# Altium schematic sheet Differential_driver.SchDoc: RP2040 CNC
size B; Author: AM; CompanyName: Expatria Technologies; DrawnBy: A.Marles; Engineer: AM; Organization: Expatria Technolgoies; Address1: PO Box 2084; Address3: Merritt, BC V1K 1B8; Address4: Canada; DocumentNumber: 12; SheetNumber: 28; SheetTotal: 28
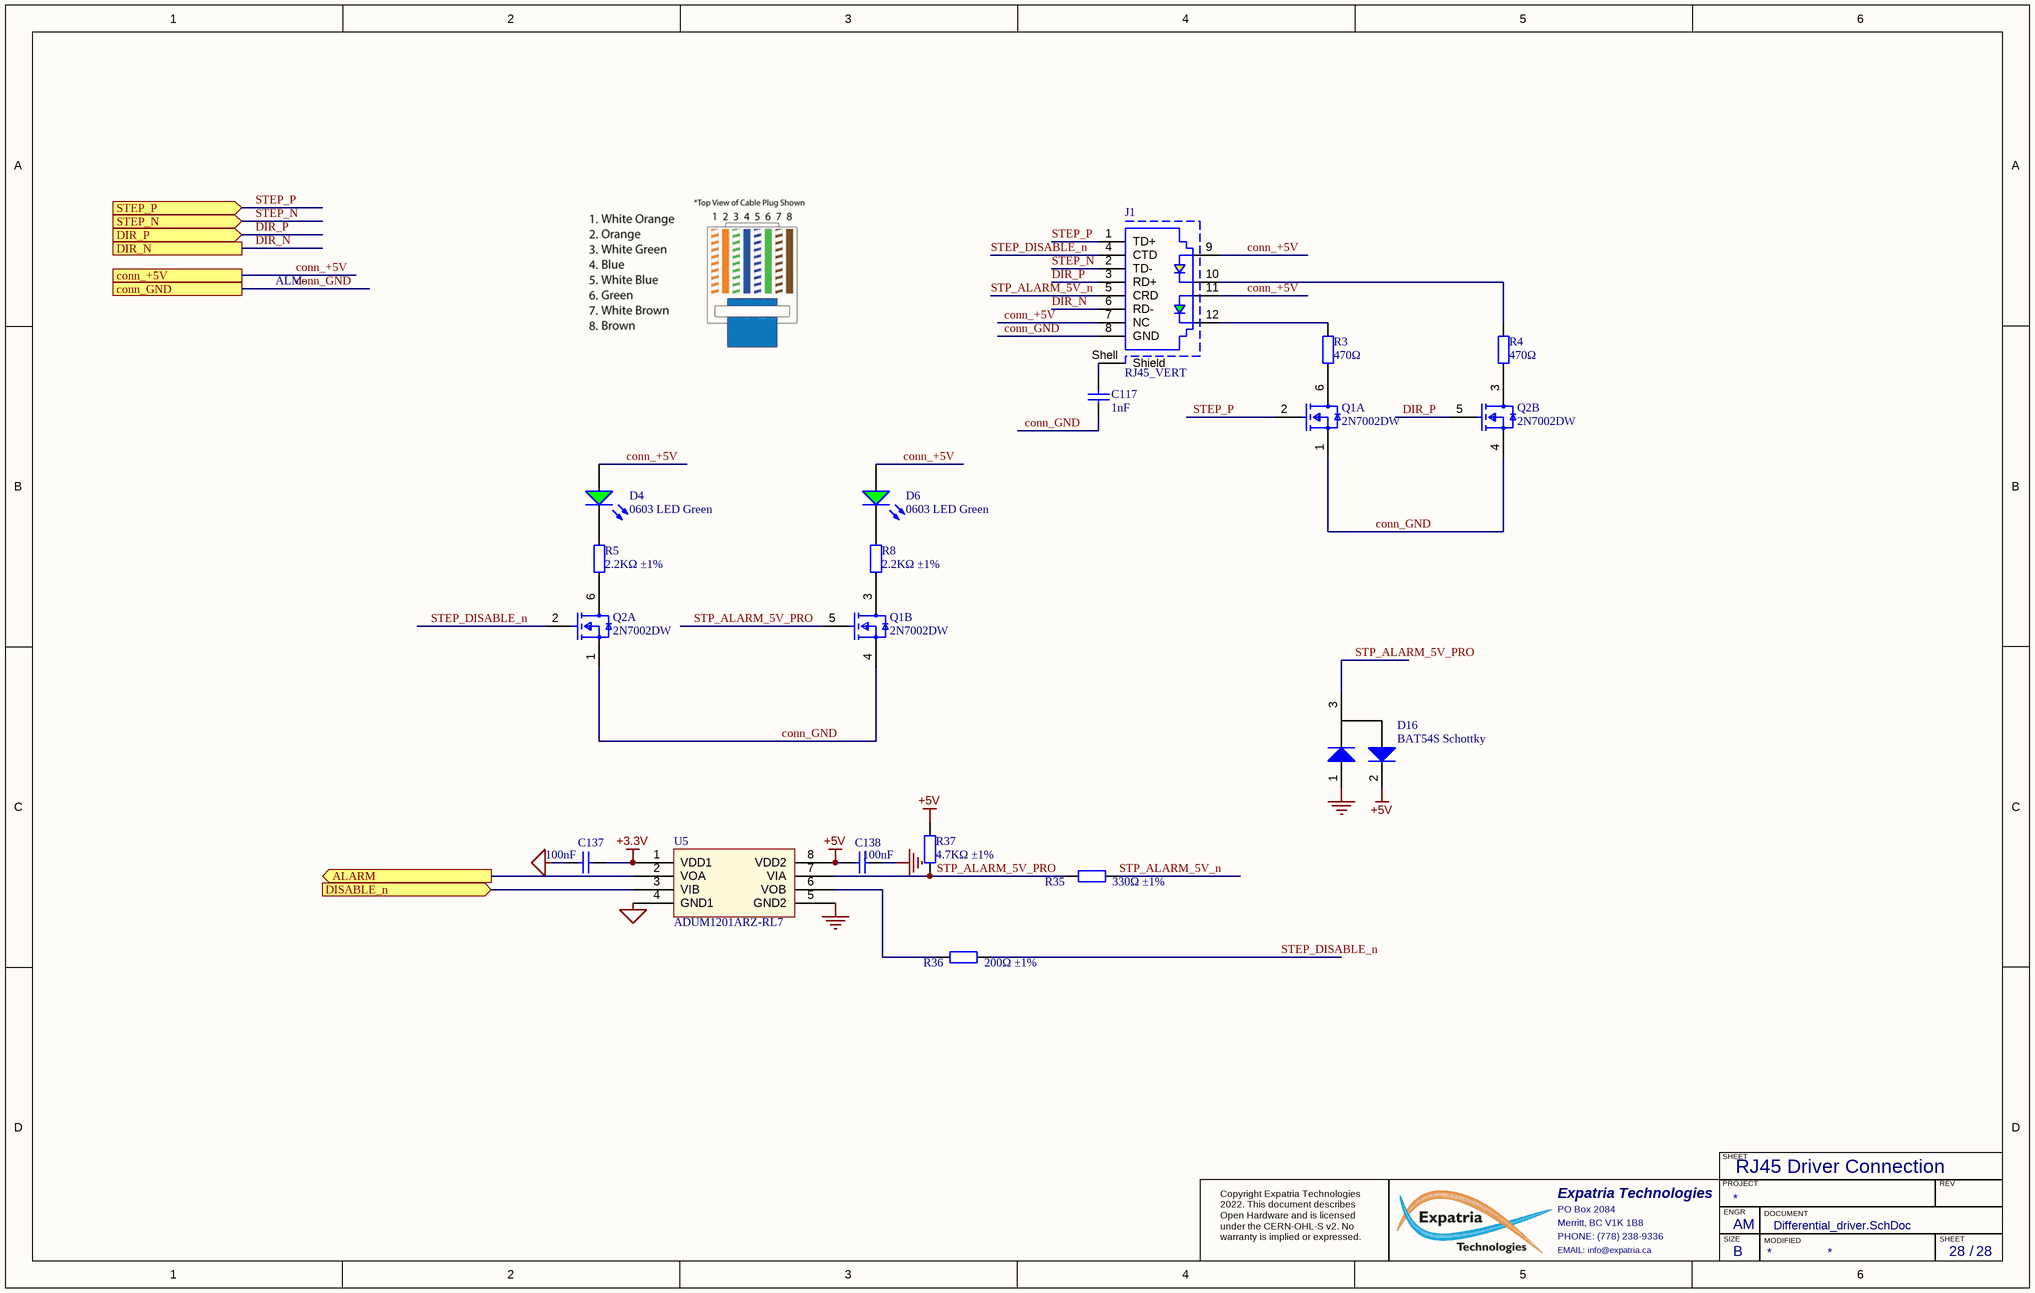
[diagram p0: Differential_driver.SchDoc]

## Parts
C117  1nF  [0603_C]
C137  100nF  [0402_C]
C138  100nF  [0402_C]
D4  0603 LED Green  [0603_LED_S1 - GREEN]
D6  0603 LED Green  [0603_LED_S1 - GREEN]
D16  BAT54S Schottky  [SOT-23(SOT-23-3)]
J1  RJ45_VERT  [74990101210]
Q1  2N7002DW  [FP-PG-SOT363-6-MFG]  (parts A,B of 2)
Q2  2N7002DW  [FP-PG-SOT363-6-MFG]  (parts A,B of 2)
R3  Resistance: 470Ω  [0402_R]  (hidden comment: 470Ω ±1%)
R4  Resistance: 470Ω  [0402_R]  (hidden comment: 470Ω ±1%)
R5  2.2KΩ ±1%  [0402_R]
R8  2.2KΩ ±1%  [0402_R]
R35  330Ω ±1%  [0402_R]
R36  200Ω ±1%  [0402_R]
R37  4.7KΩ ±1%  [0402_R]
U5  ADUM1201ARZ-RL7  [SOIC-8_150mil]

## Ports
ALARM (out), conn_+5V, conn_GND, DIR_N, DIR_P (in), DISABLE_n (in), STEP_N (in), STEP_P (in)

## Nets
+3.3V: C137.1 U5.1(VDD1)
+5V: C138.2 D16.2(A) R37.2 U5.8(VDD2)
GND: C138.1 D16.1(A) U5.5(GND2)
MCU_GND: C137.2 U5.4(GND1)
ALARM: U5.2(VOA) ; port ALARM
conn_+5V: D4.A D6.A J1.7(NC) J1.9 J1.11 ; port conn_+5V
conn_GND: C117.1 J1.8(GND) Q1.1(S1) Q1.4(S2) Q2.1(S1) Q2.4(S2) ; port conn_GND
DIR_N: J1.6(RD-) ; port DIR_N
DIR_P: J1.3(RD+) Q2.5(G2) ; port DIR_P
DISABLE_n: U5.3(VIB) ; port DISABLE_n
STEP_DISABLE_n: J1.4(CTD) Q2.2(G1) R36.2
STEP_N: J1.2(TD-) ; port STEP_N
STEP_P: J1.1(TD+) Q1.2(G1) ; port STEP_P
STP_ALARM_5V_n: J1.5(CRD) R35.2
STP_ALARM_5V_PRO: D16.3(K) Q1.5(G2) R35.1 R37.1 U5.7(VIA)
NetC117_2: C117.2 J1.Shell(Shield)
NetD4_K: D4.K R5.2
NetD6_K: D6.K R8.2
NetJ1_10: J1.10 R4.2
NetJ1_12: J1.12 R3.2
NetQ1_3: Q1.3(D2) R8.1
NetQ1_6: Q1.6(D1) R3.1
NetQ2_3: Q2.3(D2) R4.1
NetQ2_6: Q2.6(D1) R5.1
NetR36_1: R36.1 U5.6(VOB)

## Notes on the sheet
- ALM-
- RJ45 Driver Connection
- SHEET
- Expatria Technologies
- PO Box 2084
- Merritt, BC V1K 1B8
- PHONE: (778) 238-9336
- PROJECT
- SIZE
- ENGR
- MODIFIED
- DOCUMENT
- REV
- Copyright Expatria Technologies 2022. This document describes Open Hardware and is licensed under the CERN-OHL-S v2. No warranty is implied or expressed.
- EMAIL: info@expatria.ca
- B
- /

## Library data of the parts
C117 = 0603 1nF (102) 10% 50V: Chip capacitors; Manufacturer: Samsung Electro-Mechanics; PartNumber: CL10B102KB8NNNC; Tolerance: 10%; Voltage: 50V; ComponentLink1Description: Supplier link; ComponentLink1URL: http://www.szlcsc.com/product/details_1940.html; Package: 0603; Supplier: LC; SuppliersPartNumber: C1588; Capacitance: 1nF
C137 C138 = 0402 100nF (104) 10% 16V: Chip capacitors; Manufacturer: Samsung Electro-Mechanics; PartNumber: CL05B104KO5NNNC; Tolerance: 10%; Voltage: 16V; ComponentLink1Description: Supplier link; ComponentLink1URL: http://www.szlcsc.com/product/details_1877.html; Package: 0402; Supplier: LC; SuppliersPartNumber: C1525; Capacitance: 100nF
D4 D6 = 19-217/GHC-YR1S2/3T: Colorless transparence -40℃~+85℃ 520nm~535nm Emerald 120° 110mW 0603 Light Emitting Diodes (LED) ROHS; Manufacturer: Everlight Elec; Package: 0603; Supplier: LC; SuppliersPartNumber: C72043; Color: Green; Manufacturer Part Number: 19-217/GHC-YR1S2/3T
D16 = SOT-23 BAT54S: 30V Dual 200mA 800mV@100mA SOT-23 Schottky Barrier Diodes (SBD) ROHS; ComponentLink1Description: 供应商链接; ComponentLink1URL: http://www.szlcsc.com/product/details_2877.html; Package: SOT-23; Supplier: LC; SuppliersPartNumber: C916425
J1 = CMP-00005-1: Telecom and Datacom Connector, 8 Contact(s), Female, Straight, Solder Terminal; SuppliersPartNumber: C386764
Q1 Q2 = CMP-32901-000186-1: 60V 300mA 1.9Ω@10V,0.3A 300mW 2.5V 2 N-Channel SOT-363 MOSFETs ROHS; SuppliersPartNumber: C5190214
R3 R4 = 0402 470R (4700) 1%: Chip resistor; Manufacturer: Uniroyal Elec; PartNumber: 0402WGF4700TCE; Power: 1/16W; Tolerance: 1%; SuppliersPartNumber: C25117; Package: 0402; ComponentLink1URL: http://www.szlcsc.com/product/details_25860.html; ComponentLink1Description: Supplier link; Supplier: LC
R5 R8 = 0402 2.2K (2201) 1%: Chip resistor; Manufacturer: Uniroyal Elec; PartNumber: 0402WGF2201TCE; Power: 1/16W; ComponentLink1Description: Supplier link; ComponentLink1URL: http://www.szlcsc.com/product/details_26622.html; Package: 0402; Supplier: LC; SuppliersPartNumber: C25879; Resistance: 2.2KΩ; Tolerance: 1%
R35 = 0402 330R (3300) 1%: Chip resistor; Manufacturer: Uniroyal Elec; PartNumber: 0402WGF3300TCE; Power: 1/16W; ComponentLink1Description: Supplier link; ComponentLink1URL: http://www.szlcsc.com/product/details_25847.html; Package: 0402; Supplier: LC; SuppliersPartNumber: C25104; Resistance: 330Ω; Tolerance: 1%
R36 = 0402 200R (2000) 1%: Chip resistor; Manufacturer: Uniroyal Elec; PartNumber: 0402WGF2000TCE; Power: 1/16W; ComponentLink1Description: Supplier link; ComponentLink1URL: http://www.szlcsc.com/product/details_25830.html; Package: 0402; Supplier: LC; SuppliersPartNumber: C25087; Resistance: 200Ω; Tolerance: 1%
R37 = 0402 4.7K (4701) 1%: Chip resistor; Manufacturer: Uniroyal Elec; PartNumber: 0402WGF4701TCE; Power: 1/16W; ComponentLink1Description: Supplier link; ComponentLink1URL: http://www.szlcsc.com/product/details_26643.html; Package: 0402; Supplier: LC; SuppliersPartNumber: C25900; Resistance: 4.7KΩ; Tolerance: 1%
U5 = ADUM1201ARZ-RL7_[C9669]: Dual Channel Isolator; ComponentLink1Description: 供应商链接; ComponentLink1URL: http://www.szlcsc.com/product/details_10199.html; Package: SOIC-8_150mil; Supplier: LC; SuppliersPartNumber: C9669